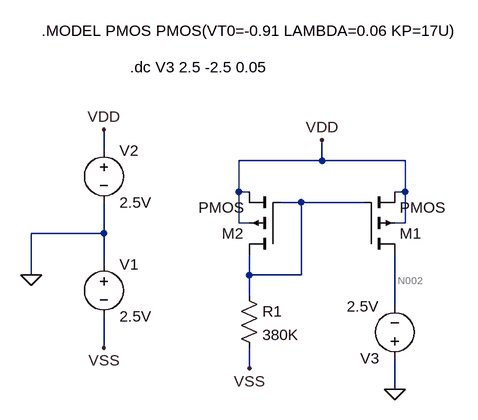
[diagram p0: schematic CurrentSource_10uA.asc]
CurrentSource_10uA.asc, the LTspice schematic file:
Version 4
SHEET 1 880 680
WIRE -96 64 -96 32
WIRE 240 80 240 48
WIRE 240 80 112 80
WIRE 368 80 240 80
WIRE 112 128 112 80
WIRE 128 128 112 128
WIRE 368 128 368 80
WIRE 368 128 352 128
WIRE 208 144 176 144
WIRE 304 144 208 144
WIRE 112 176 112 128
WIRE 128 176 112 176
WIRE 368 176 368 128
WIRE 368 176 352 176
WIRE -96 192 -96 144
WIRE -96 192 -208 192
WIRE -96 240 -96 192
WIRE -208 256 -208 192
WIRE 128 256 128 224
WIRE 208 256 208 144
WIRE 208 256 128 256
WIRE 128 288 128 256
WIRE 352 304 352 224
WIRE -96 368 -96 320
WIRE 128 400 128 368
WIRE 352 432 352 384
FLAG 352 432 0
FLAG -208 256 0
FLAG -96 32 VDD
FLAG -96 368 VSS
FLAG 240 48 VDD
FLAG 128 400 VSS
SYMBOL voltage -96 224 R0
WINDOW 123 0 0 Left 2
WINDOW 39 0 0 Left 2
SYMATTR InstName V1
SYMATTR Value 2.5V
SYMBOL voltage -96 48 R0
WINDOW 123 0 0 Left 2
WINDOW 39 0 0 Left 2
SYMATTR InstName V2
SYMATTR Value 2.5V
SYMBOL voltage 352 400 R180
WINDOW 123 0 0 Left 2
WINDOW 39 0 0 Left 2
SYMATTR InstName V3
SYMATTR Value 2.5V
SYMBOL res 112 272 R0
SYMATTR InstName R1
SYMATTR Value 380K
SYMBOL pmos4 176 224 R180
SYMATTR InstName M2
SYMATTR Value2 l=5 w=70
SYMBOL pmos4 304 224 M180
SYMATTR InstName M1
SYMATTR Value2 l=5 w=70
TEXT -192 -120 Left 2 !.MODEL PMOS PMOS(VT0=-0.91 LAMBDA=0.06 KP=17U)
TEXT -56 -64 Left 2 !.dc V3 2.5 -2.5 0.05

The netlist it stands for:
* CurrentSource_10uA.asc
V1 0 VSS 2.5V
V2 VDD 0 2.5V
V3 0 N002 2.5V
R1 N001 VSS 380K
M2 N001 N001 VDD VDD PMOS l=5 w=70
M1 N002 N001 VDD VDD PMOS l=5 w=70
.model NMOS NMOS
.model PMOS PMOS
.lib standard.mos
.MODEL PMOS PMOS(VT0=-0.91 LAMBDA=0.06 KP=17U)
.dc V3 2.5 -2.5 0.05
.backanno
.end

* Results of the author's LTspice run, read from the files saved beside the schematic
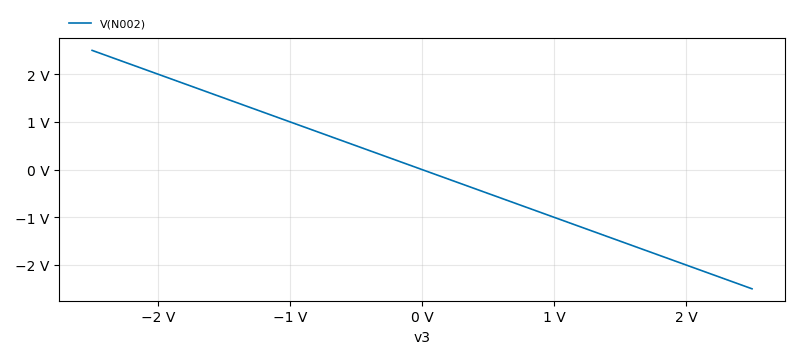
[diagram p1: DC transfer characteristic of CurrentSource_10uA.asc, plotted from the saved traces]
* DC transfer characteristic, 1 run:
*   V(N002): -2.5 V at v3=2.5 V, 2.5 V at v3=-2.5 V, min -2.5 V, max 2.5 V